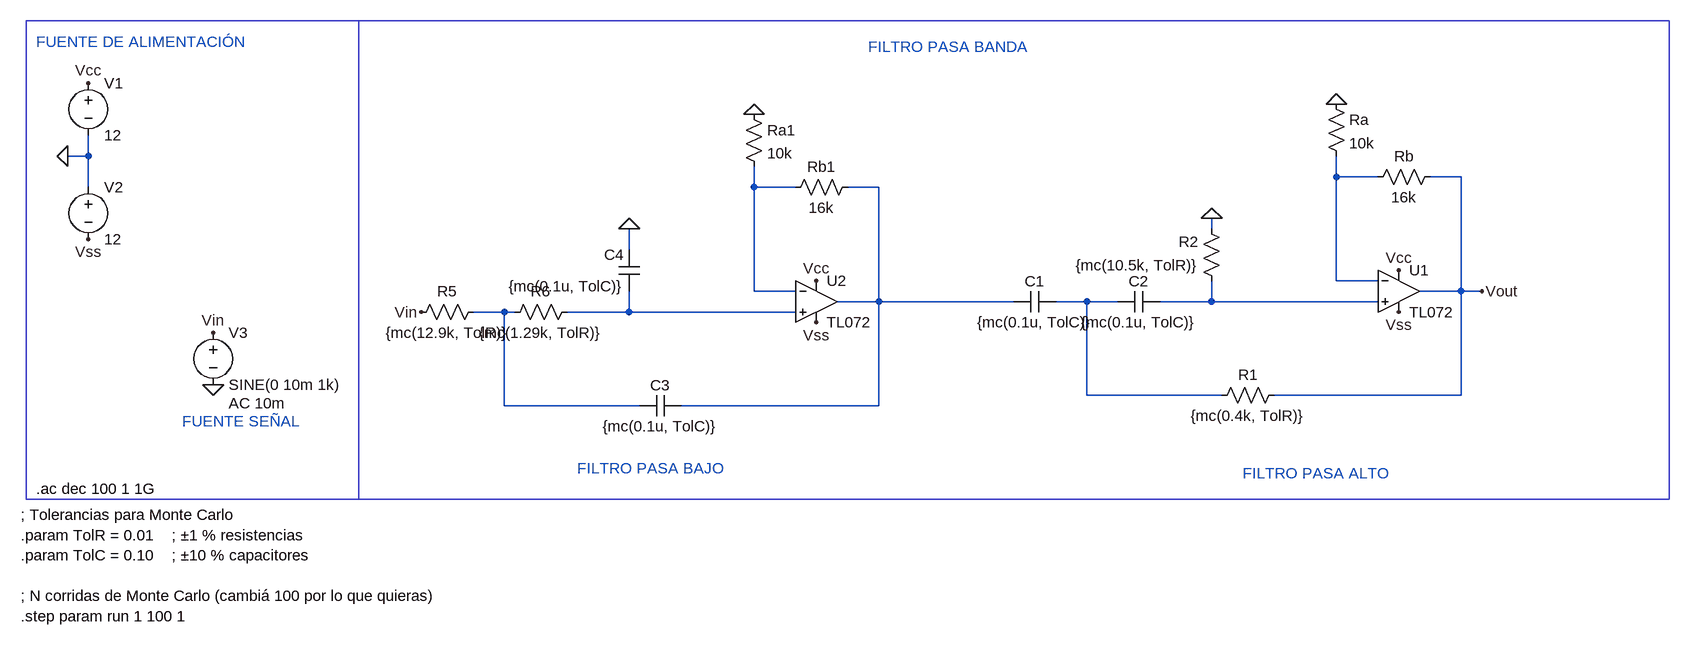
[diagram p0: schematic filtro_pb_pa.asc]
filtro_pb_pa.asc, the LTspice schematic file:
Version 4
SHEET 1 1668 724
WIRE -800 16 -800 -16
WIRE -800 16 -832 16
WIRE 1120 48 1120 16
WIRE 1184 48 1120 48
WIRE 1312 48 1264 48
WIRE -800 64 -800 16
WIRE 224 64 224 32
WIRE 288 64 224 64
WIRE 416 64 368 64
WIRE 928 128 928 112
WIRE 32 160 32 128
WIRE 1120 208 1120 48
WIRE 1184 208 1120 208
WIRE 224 224 224 64
WIRE 288 224 224 224
WIRE 1312 224 1312 48
WIRE 1312 224 1248 224
WIRE 1344 224 1312 224
WIRE 416 240 416 64
WIRE 416 240 352 240
WIRE 624 240 416 240
WIRE 736 240 688 240
WIRE 784 240 736 240
WIRE 928 240 928 208
WIRE 928 240 848 240
WIRE 1184 240 928 240
WIRE -160 256 -208 256
WIRE -144 256 -160 256
WIRE 32 256 32 224
WIRE 32 256 -64 256
WIRE 288 256 32 256
WIRE 736 384 736 240
WIRE 944 384 736 384
WIRE 1312 384 1312 224
WIRE 1312 384 1024 384
WIRE -160 400 -160 256
WIRE 48 400 -160 400
WIRE 416 400 416 240
WIRE 416 400 112 400
FLAG 1120 -64 0
FLAG 928 112 0
FLAG 1216 192 Vcc
FLAG 1216 256 Vss
FLAG 1344 224 Vout
FLAG -608 368 0
FLAG -800 -96 Vcc
FLAG -800 144 Vss
FLAG -832 16 0
FLAG 224 -48 0
FLAG 32 128 0
FLAG -288 256 Vin
FLAG 320 208 Vcc
FLAG 320 272 Vss
FLAG -608 288 Vin
SYMBOL ZZZ\\OpAmp\\TL072 1216 224 R0
SYMATTR InstName U1
SYMBOL res 1280 32 R90
WINDOW 0 0 56 VBottom 2
WINDOW 3 32 56 VTop 2
SYMATTR InstName Rb
SYMATTR Value 16k
SYMBOL res 1104 -80 R0
SYMATTR InstName Ra
SYMATTR Value 10k
SYMBOL voltage -800 -112 R0
WINDOW 123 0 0 Left 0
WINDOW 39 0 0 Left 0
SYMATTR InstName V1
SYMATTR Value 12
SYMBOL voltage -800 48 R0
WINDOW 123 0 0 Left 0
WINDOW 39 0 0 Left 0
SYMATTR InstName V2
SYMATTR Value 12
SYMBOL voltage -608 272 R0
WINDOW 123 24 124 Left 2
WINDOW 39 0 0 Left 0
SYMATTR Value2 AC 10m
SYMATTR InstName V3
SYMATTR Value SINE(0 10m 1k)
SYMBOL cap 688 224 R90
WINDOW 0 0 32 VBottom 2
WINDOW 3 32 32 VTop 2
SYMATTR InstName C1
SYMATTR Value {mc(0.1u, TolC)}
SYMBOL cap 848 224 R90
WINDOW 0 0 32 VBottom 2
WINDOW 3 32 32 VTop 2
SYMATTR InstName C2
SYMATTR Value {mc(0.1u, TolC)}
SYMBOL res 1040 368 R90
WINDOW 0 0 56 VBottom 2
WINDOW 3 32 56 VTop 2
SYMATTR InstName R1
SYMATTR Value {mc(0.4k, TolR)}
SYMBOL res 944 224 R180
WINDOW 0 36 76 Left 2
WINDOW 3 36 40 Left 2
SYMATTR InstName R2
SYMATTR Value {mc(10.5k, TolR)}
SYMBOL ZZZ\\OpAmp\\TL072 320 240 R0
SYMATTR InstName U2
SYMBOL res 384 48 R90
WINDOW 0 0 56 VBottom 2
WINDOW 3 32 56 VTop 2
SYMATTR InstName Rb1
SYMATTR Value 16k
SYMBOL res 208 -64 R0
SYMATTR InstName Ra1
SYMATTR Value 10k
SYMBOL res -192 240 R90
WINDOW 0 0 56 VBottom 2
WINDOW 3 32 56 VTop 2
SYMATTR InstName R5
SYMATTR Value {mc(12.9k, TolR)}
SYMBOL res -48 240 R90
WINDOW 0 0 56 VBottom 2
WINDOW 3 32 56 VTop 2
SYMATTR InstName R6
SYMATTR Value {mc(1.29k, TolR)}
SYMBOL cap 112 384 R90
WINDOW 0 0 32 VBottom 2
WINDOW 3 32 32 VTop 2
SYMATTR InstName C3
SYMATTR Value {mc(0.1u, TolC)}
SYMBOL cap 48 224 R180
WINDOW 0 24 56 Left 2
WINDOW 3 24 8 Left 2
SYMATTR InstName C4
SYMATTR Value {mc(0.1u, TolC)}
TEXT -880 -160 Left 2 ;FUENTE DE ALIMENTACIÓN
TEXT -656 424 Left 2 ;FUENTE SEÑAL
TEXT 400 -152 Left 2 ;FILTRO PASA BANDA
TEXT -48 496 Left 2 ;FILTRO PASA BAJO
TEXT 976 504 Left 2 ;FILTRO PASA ALTO
TEXT -880 528 Left 2 !.ac dec 100 1 1G
TEXT -904 568 Left 2 !; Tolerancias para Monte Carlo\n.param TolR = 0.01    ; ±1 % resistencias\n.param TolC = 0.10    ; ±10 % capacitores\n \n; N corridas de Monte Carlo (cambiá 100 por lo que quieras)\n.step param run 1 100 1
RECTANGLE Normal -384 544 -896 -192
RECTANGLE Normal -384 -192 -384 -192 2
RECTANGLE Normal 1632 544 -384 -192

The netlist it stands for:
* filtro_pb_pa.asc
* U1: TL072 (symbol ZZZ\OpAmp\TL072 not available, pins judged from their places): In+=N005 In-=N001 V+=Vcc V-=Vss OUT=Vout
Rb Vout N001 16k
Ra 0 N001 10k
V1 Vcc 0 12
V2 0 Vss 12
V3 Vin 0 SINE(0 10m 1k) AC 10m
C1 N004 N003 {mc(0.1u, TolC)}
C2 N005 N004 {mc(0.1u, TolC)}
R1 Vout N004 {mc(0.4k, TolR)}
R2 N005 0 {mc(10.5k, TolR)}
* U2: TL072 (symbol ZZZ\OpAmp\TL072 not available, pins judged from their places): In+=N007 In-=N002 V+=Vcc V-=Vss OUT=N003
Rb1 N003 N002 16k
Ra1 0 N002 10k
R5 N006 Vin {mc(12.9k, TolR)}
R6 N007 N006 {mc(1.29k, TolR)}
C3 N003 N006 {mc(0.1u, TolC)}
C4 N007 0 {mc(0.1u, TolC)}
* FUENTE DE ALIMENTACIÓN
* FUENTE SEÑAL
* FILTRO PASA BANDA
* FILTRO PASA BAJO
* FILTRO PASA ALTO
.ac dec 100 1 1G
; Tolerancias para Monte Carlo
.param TolR = 0.01    ; ±1 % resistencias
.param TolC = 0.10    ; ±10 % capacitores
; N corridas de Monte Carlo (cambiá 100 por lo que quieras)
.step param run 1 100 1
.backanno
.end